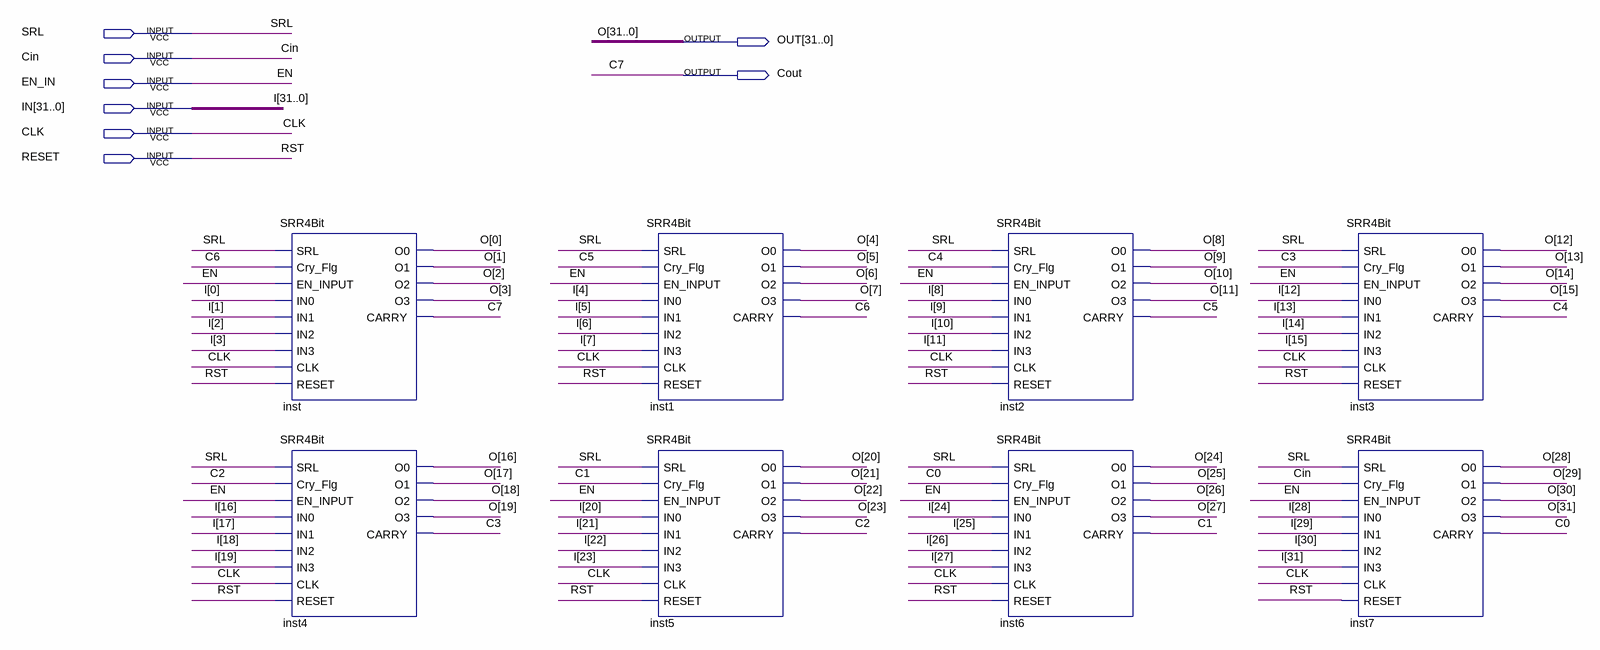
[diagram p0: schematic sheet]
// Quartus schematic SRR32Bit.bdf as structural Verilog: 8 symbols, 8 pins
module SRR32Bit (
  input  SRL,
  input  Cin,
  input  EN_IN,
  input  [31:0] IN,
  input  CLK,
  input  RESET,
  output [31:0] OUT,
  output Cout
);

  wire C0, C1, C2, C3, C4, C5, C6;

  SRR4Bit inst (
    .SRL(SRL), .Cry_Flg(C6), .EN_INPUT(EN_IN), .IN0(IN[0]), .IN1(IN[1]), .IN2(IN[2]), .IN3(IN[3]), .CLK(CLK),
    .RESET(RESET), .O0(OUT[0]), .O1(OUT[1]), .O2(OUT[2]), .O3(OUT[3]), .CARRY(Cout));
  SRR4Bit inst4 (
    .SRL(SRL), .Cry_Flg(C2), .EN_INPUT(EN_IN), .IN0(IN[16]), .IN1(IN[17]), .IN2(IN[18]), .IN3(IN[19]),
    .CLK(CLK), .RESET(RESET), .O0(OUT[16]), .O1(OUT[17]), .O2(OUT[18]), .O3(OUT[19]), .CARRY(C3));
  SRR4Bit inst1 (
    .SRL(SRL), .Cry_Flg(C5), .EN_INPUT(EN_IN), .IN0(IN[4]), .IN1(IN[5]), .IN2(IN[6]), .IN3(IN[7]), .CLK(CLK),
    .RESET(RESET), .O0(OUT[4]), .O1(OUT[5]), .O2(OUT[6]), .O3(OUT[7]), .CARRY(C6));
  SRR4Bit inst5 (
    .SRL(SRL), .Cry_Flg(C1), .EN_INPUT(EN_IN), .IN0(IN[20]), .IN1(IN[21]), .IN2(IN[22]), .IN3(IN[23]),
    .CLK(CLK), .RESET(RESET), .O0(OUT[20]), .O1(OUT[21]), .O2(OUT[22]), .O3(OUT[23]), .CARRY(C2));
  SRR4Bit inst2 (
    .SRL(SRL), .Cry_Flg(C4), .EN_INPUT(EN_IN), .IN0(IN[8]), .IN1(IN[9]), .IN2(IN[10]), .IN3(IN[11]),
    .CLK(CLK), .RESET(RESET), .O0(OUT[8]), .O1(OUT[9]), .O2(OUT[10]), .O3(OUT[11]), .CARRY(C5));
  SRR4Bit inst6 (
    .SRL(SRL), .Cry_Flg(C0), .EN_INPUT(EN_IN), .IN0(IN[24]), .IN1(IN[25]), .IN2(IN[26]), .IN3(IN[27]),
    .CLK(CLK), .RESET(RESET), .O0(OUT[24]), .O1(OUT[25]), .O2(OUT[26]), .O3(OUT[27]), .CARRY(C1));
  SRR4Bit inst3 (
    .SRL(SRL), .Cry_Flg(C3), .EN_INPUT(EN_IN), .IN0(IN[12]), .IN1(IN[13]), .IN2(IN[14]), .IN3(IN[15]),
    .CLK(CLK), .RESET(RESET), .O0(OUT[12]), .O1(OUT[13]), .O2(OUT[14]), .O3(OUT[15]), .CARRY(C4));
  SRR4Bit inst7 (
    .SRL(SRL), .Cry_Flg(Cin), .EN_INPUT(EN_IN), .IN0(IN[28]), .IN1(IN[29]), .IN2(IN[30]), .IN3(IN[31]),
    .CLK(CLK), .RESET(RESET), .O0(OUT[28]), .O1(OUT[29]), .O2(OUT[30]), .O3(OUT[31]), .CARRY(C0));

  // Other names for the same wires on the sheet: C7 = Cout; EN = EN_IN; I[31:0] = IN; O[31:0] = OUT; RST = RESET
endmodule
